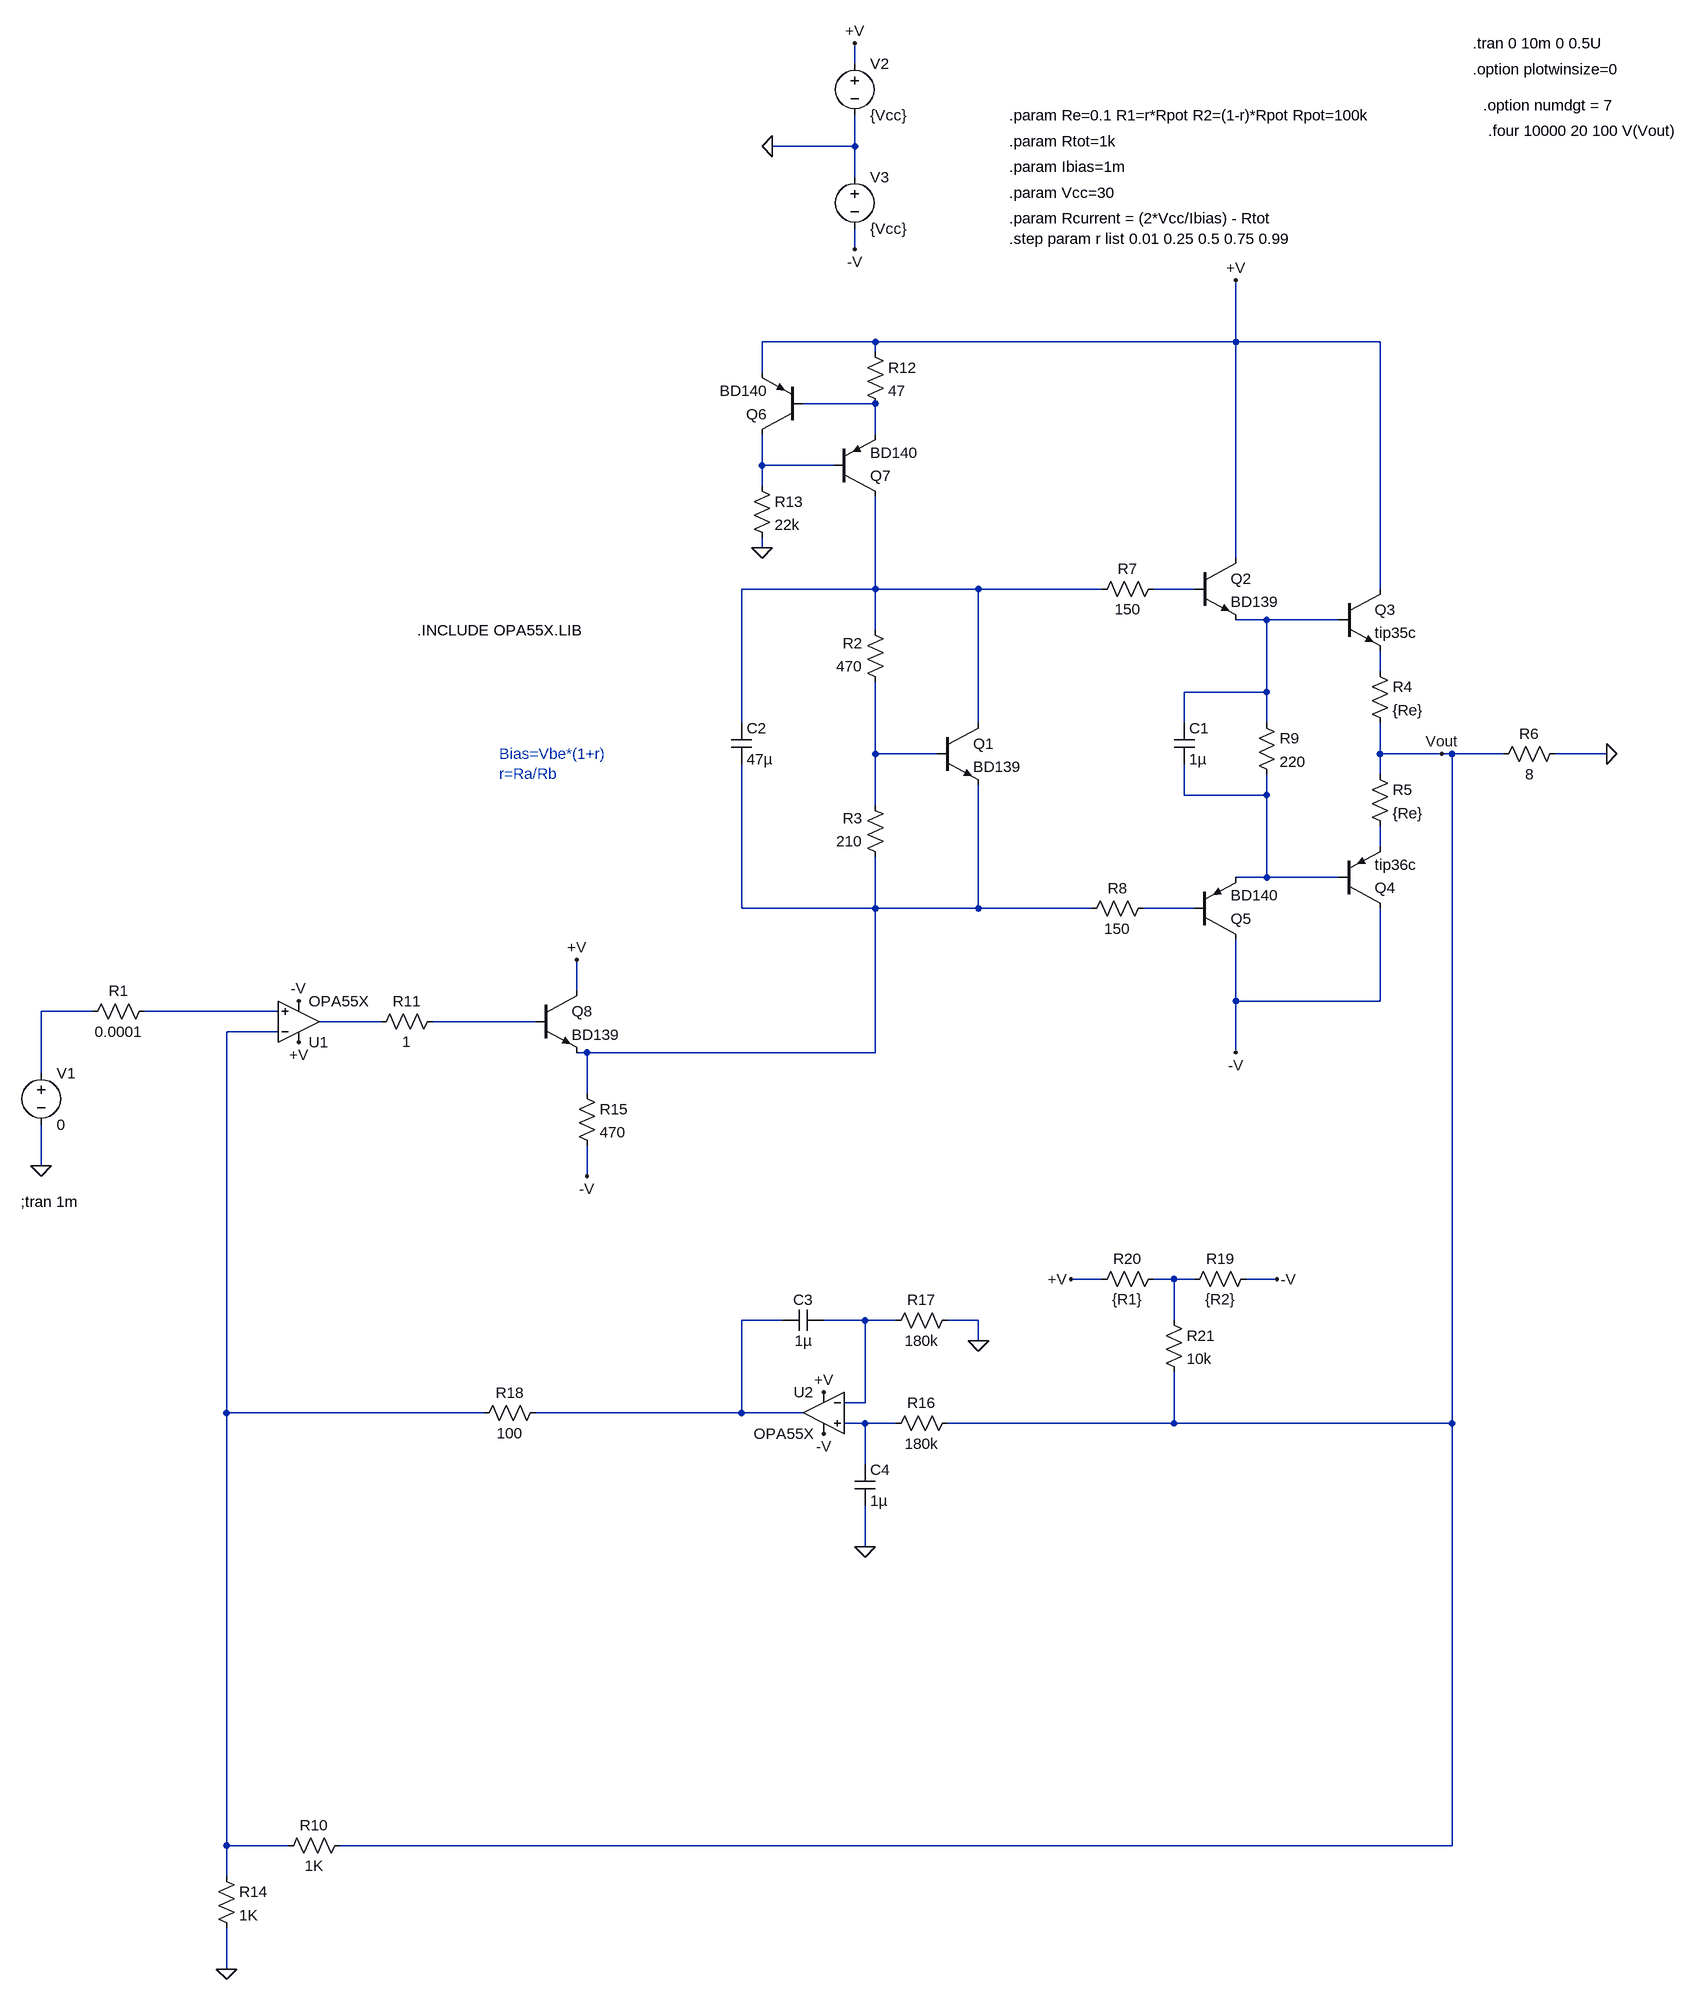
[diagram p0: schematic V3 SERVO - DC.asc]
V3 SERVO - DC.asc, the LTspice schematic file:
Version 4
SHEET 1 1304 1988
WIRE 0 -992 0 -1024
WIRE 0 -864 0 -912
WIRE 0 -864 -128 -864
WIRE 0 -816 0 -864
WIRE 0 -704 0 -736
WIRE 32 -560 -144 -560
WIRE 592 -560 592 -656
WIRE 592 -560 32 -560
WIRE 816 -560 592 -560
WIRE 32 -544 32 -560
WIRE -144 -512 -144 -560
WIRE 32 -464 -80 -464
WIRE 32 -416 32 -464
WIRE -144 -368 -144 -416
WIRE -32 -368 -144 -368
WIRE -144 -336 -144 -368
WIRE -144 -240 -144 -256
WIRE 592 -224 592 -560
WIRE 32 -176 32 -320
WIRE 32 -176 -176 -176
WIRE 192 -176 32 -176
WIRE 384 -176 192 -176
WIRE 528 -176 464 -176
WIRE 816 -176 816 -560
WIRE 640 -128 592 -128
WIRE 752 -128 640 -128
WIRE 32 -112 32 -176
WIRE 816 -48 816 -80
WIRE 640 -16 640 -128
WIRE 640 -16 512 -16
WIRE -176 32 -176 -176
WIRE 192 32 192 -176
WIRE 512 32 512 -16
WIRE 640 32 640 -16
WIRE 32 80 32 -32
WIRE 128 80 32 80
WIRE 816 80 816 32
WIRE 912 80 816 80
WIRE 928 80 912 80
WIRE 1008 80 928 80
WIRE 1168 80 1088 80
WIRE 816 112 816 80
WIRE 512 144 512 96
WIRE 640 144 640 112
WIRE 640 144 512 144
WIRE 32 160 32 80
WIRE 816 224 816 192
WIRE 640 272 640 144
WIRE 640 272 592 272
WIRE 752 272 640 272
WIRE -176 320 -176 96
WIRE 32 320 32 240
WIRE 32 320 -176 320
WIRE 192 320 192 128
WIRE 192 320 32 320
WIRE 368 320 192 320
WIRE 528 320 448 320
WIRE -432 448 -432 400
WIRE 592 464 592 368
WIRE 816 464 816 320
WIRE 816 464 592 464
WIRE -1184 480 -1264 480
WIRE -896 480 -1104 480
WIRE -736 496 -832 496
WIRE -496 496 -656 496
WIRE -896 512 -976 512
WIRE -416 544 -432 544
WIRE 32 544 32 320
WIRE 32 544 -416 544
WIRE 592 544 592 464
WIRE -1264 576 -1264 480
WIRE -416 608 -416 544
WIRE -1264 720 -1264 656
WIRE -416 736 -416 688
WIRE 384 896 336 896
WIRE 496 896 464 896
WIRE 528 896 496 896
WIRE 656 896 608 896
WIRE -112 960 -176 960
WIRE 16 960 -48 960
WIRE 64 960 16 960
WIRE 192 960 144 960
WIRE 496 960 496 896
WIRE 192 992 192 960
WIRE 16 1088 16 960
WIRE 16 1088 -16 1088
WIRE -976 1104 -976 512
WIRE -576 1104 -976 1104
WIRE -176 1104 -176 960
WIRE -176 1104 -496 1104
WIRE -80 1104 -176 1104
WIRE 16 1120 -16 1120
WIRE 64 1120 16 1120
WIRE 496 1120 496 1040
WIRE 496 1120 144 1120
WIRE 928 1120 928 80
WIRE 928 1120 496 1120
WIRE 16 1184 16 1120
WIRE 16 1312 16 1248
WIRE -976 1776 -976 1104
WIRE -880 1776 -976 1776
WIRE 928 1776 928 1120
WIRE 928 1776 -800 1776
WIRE -976 1824 -976 1776
WIRE -976 1968 -976 1904
FLAG 592 -656 +V
FLAG 592 544 -V
FLAG -1264 720 0
FLAG -128 -864 0
FLAG 0 -1024 +V
FLAG 0 -704 -V
FLAG 1168 80 0
FLAG 912 80 Vout
FLAG -864 528 +V
FLAG -864 464 -V
FLAG -144 -240 0
FLAG -976 1968 0
FLAG -432 400 +V
FLAG -416 736 -V
FLAG -48 1072 +V
FLAG -48 1136 -V
FLAG 192 992 0
FLAG 16 1312 0
FLAG 336 896 +V
FLAG 656 896 -V
SYMBOL voltage -1264 560 R0
WINDOW 123 0 0 Left 0
WINDOW 39 0 0 Left 0
SYMATTR InstName V1
SYMATTR Value 0
SYMBOL res -1088 464 R90
WINDOW 0 0 56 VBottom 2
WINDOW 3 32 56 VTop 2
SYMATTR InstName R1
SYMATTR Value 0.0001
SYMBOL res 48 -16 R180
WINDOW 0 36 76 Left 2
WINDOW 3 36 40 Left 2
SYMATTR InstName R2
SYMATTR Value 470
SYMBOL res 48 256 R180
WINDOW 0 36 76 Left 2
WINDOW 3 36 40 Left 2
SYMATTR InstName R3
SYMATTR Value 210
SYMBOL npn 128 32 R0
SYMATTR InstName Q1
SYMATTR Value BD139
SYMBOL npn 528 -224 R0
SYMATTR InstName Q2
SYMATTR Value BD139
SYMBOL npn 752 -176 R0
SYMATTR InstName Q3
SYMATTR Value tip35c
SYMBOL pnp 752 320 M180
SYMATTR InstName Q4
SYMATTR Value tip36c
SYMBOL pnp 528 368 M180
SYMATTR InstName Q5
SYMATTR Value BD140
SYMBOL res 800 -64 R0
SYMATTR InstName R4
SYMATTR Value {Re}
SYMBOL res 800 96 R0
SYMATTR InstName R5
SYMATTR Value {Re}
SYMBOL voltage 0 -1008 R0
WINDOW 123 0 0 Left 0
WINDOW 39 0 0 Left 0
SYMATTR InstName V2
SYMATTR Value {Vcc}
SYMBOL voltage 0 -832 R0
WINDOW 123 0 0 Left 0
WINDOW 39 0 0 Left 0
SYMATTR InstName V3
SYMATTR Value {Vcc}
SYMBOL res 1104 64 R90
WINDOW 0 0 56 VBottom 2
WINDOW 3 32 56 VTop 2
SYMATTR InstName R6
SYMATTR Value 8
SYMBOL res 480 -192 R90
WINDOW 0 0 56 VBottom 2
WINDOW 3 32 56 VTop 2
SYMATTR InstName R7
SYMATTR Value 150
SYMBOL res 464 304 R90
WINDOW 0 0 56 VBottom 2
WINDOW 3 32 56 VTop 2
SYMATTR InstName R8
SYMATTR Value 150
SYMBOL res 624 16 R0
SYMATTR InstName R9
SYMATTR Value 220
SYMBOL cap 496 32 R0
SYMATTR InstName C1
SYMATTR Value 1µ
SYMBOL cap -192 32 R0
SYMATTR InstName C2
SYMATTR Value 47µ
SYMBOL OpAmps\\opamp2 -864 560 M180
SYMATTR InstName U1
SYMATTR Value OPA55X
SYMBOL res -784 1760 R90
WINDOW 0 0 56 VBottom 2
WINDOW 3 32 56 VTop 2
SYMATTR InstName R10
SYMATTR Value 1K
SYMBOL res -640 480 R90
WINDOW 0 0 56 VBottom 2
WINDOW 3 32 56 VTop 2
SYMATTR InstName R11
SYMATTR Value 1
SYMBOL pnp -80 -416 R180
SYMATTR InstName Q6
SYMATTR Value BD140
SYMBOL res 16 -560 R0
SYMATTR InstName R12
SYMATTR Value 47
SYMBOL pnp -32 -320 M180
SYMATTR InstName Q7
SYMATTR Value BD140
SYMBOL res -160 -352 R0
SYMATTR InstName R13
SYMATTR Value 22k
SYMBOL res -992 1808 R0
SYMATTR InstName R14
SYMATTR Value 1K
SYMBOL npn -496 448 R0
SYMATTR InstName Q8
SYMATTR Value BD139
SYMBOL res -432 592 R0
SYMATTR InstName R15
SYMATTR Value 470
SYMBOL OpAmps\\opamp2 -48 1040 M0
SYMATTR InstName U2
SYMATTR Value OPA55X
SYMBOL res 160 1104 R90
WINDOW 0 0 56 VBottom 2
WINDOW 3 32 56 VTop 2
SYMATTR InstName R16
SYMATTR Value 180k
SYMBOL res 160 944 R90
WINDOW 0 0 56 VBottom 2
WINDOW 3 32 56 VTop 2
SYMATTR InstName R17
SYMATTR Value 180k
SYMBOL cap -48 944 R90
WINDOW 0 0 32 VBottom 2
WINDOW 3 32 32 VTop 2
SYMATTR InstName C3
SYMATTR Value 1µ
SYMBOL cap 0 1184 R0
SYMATTR InstName C4
SYMATTR Value 1µ
SYMBOL res -480 1088 R90
WINDOW 0 0 56 VBottom 2
WINDOW 3 32 56 VTop 2
SYMATTR InstName R18
SYMATTR Value 100
SYMBOL res 624 880 R90
WINDOW 0 0 56 VBottom 2
WINDOW 3 32 56 VTop 2
SYMATTR InstName R19
SYMATTR Value {R2}
SYMBOL res 480 880 R90
WINDOW 0 0 56 VBottom 2
WINDOW 3 32 56 VTop 2
SYMATTR InstName R20
SYMATTR Value {R1}
SYMBOL res 480 944 R0
SYMATTR InstName R21
SYMATTR Value 10k
TEXT -552 80 Left 2 ;Bias=Vbe*(1+r)\nr=Ra/Rb
TEXT 240 -872 Left 2 !.param Rtot=1k
TEXT 240 -832 Left 2 !.param Ibias=1m
TEXT 240 -792 Left 2 !.param Vcc=30
TEXT 240 -752 Left 2 !.param Rcurrent = (2*Vcc/Ibias) - Rtot
TEXT -1296 776 Left 2 !;tran 1m
TEXT 960 -1024 Left 2 !.tran 0 10m 0 0.5U
TEXT 960 -984 Left 2 !.option plotwinsize=0
TEXT 976 -928 Left 2 !.option numdgt = 7
TEXT 984 -888 Left 2 !.four 10000 20 100 V(Vout)
TEXT -680 -112 Left 2 !.INCLUDE OPA55X.LIB
TEXT 240 -912 Left 2 !.param Re=0.1 R1=r*Rpot R2=(1-r)*Rpot Rpot=100k
TEXT 240 -720 Left 2 !.step param r list 0.01 0.25 0.5 0.75 0.99

The netlist it stands for:
* V3 SERVO - DC.asc
V1 N012 0 0
R1 N013 N012 0.0001
R2 N007 N003 470
R3 N010 N007 210
Q1 N003 N007 N010 0 BD139
Q2 +V N004 N005 0 BD139
Q3 +V N005 N006 0 tip35c
Q4 -V N008 N009 0 tip36c
Q5 -V N011 N008 0 BD140
R4 N006 Vout {Re}
R5 Vout N009 {Re}
V2 +V 0 {Vcc}
V3 0 -V {Vcc}
R6 0 Vout 8
R7 N004 N003 150
R8 N011 N010 150
R9 N005 N008 220
C1 N005 N008 1µ
C2 N003 N010 47µ
XU1 N013 N016 +V -V N014 OPA55X  ; pins In+ In- V+ V- OUT
R10 Vout N016 1K
R11 N015 N014 1
Q6 N002 N001 +V 0 BD140
R12 +V N001 47
Q7 N003 N002 N001 0 BD140
R13 N002 0 22k
R14 N016 0 1K
Q8 +V N015 N010 0 BD139
R15 N010 -V 470
XU2 N020 N019 +V -V N018 OPA55X  ; pins In+ In- V+ V- OUT
R16 Vout N020 180k
R17 0 N019 180k
C3 N019 N018 1µ
C4 N020 0 1µ
R18 N018 N016 100
R19 -V N017 {R2}
R20 N017 +V {R1}
R21 N017 Vout 10k
.model NPN NPN
.model PNP PNP
.lib standard.bjt
* Bias=Vbe*(1+r)
* r=Ra/Rb
.param Rtot=1k
.param Ibias=1m
.param Vcc=30
.param Rcurrent = (2*Vcc/Ibias) - Rtot
;tran 1m
.tran 0 10m 0 0.5U
.option plotwinsize=0
.option numdgt = 7
.four 10000 20 100 V(Vout)
.INCLUDE OPA55X.LIB
.param Re=0.1 R1=r*Rpot R2=(1-r)*Rpot Rpot=100k
.step param r list 0.01 0.25 0.5 0.75 0.99
.backanno
.end